# EAGLE design Qwiic_RTC_RV8803 (EAGLE 9.5.2)
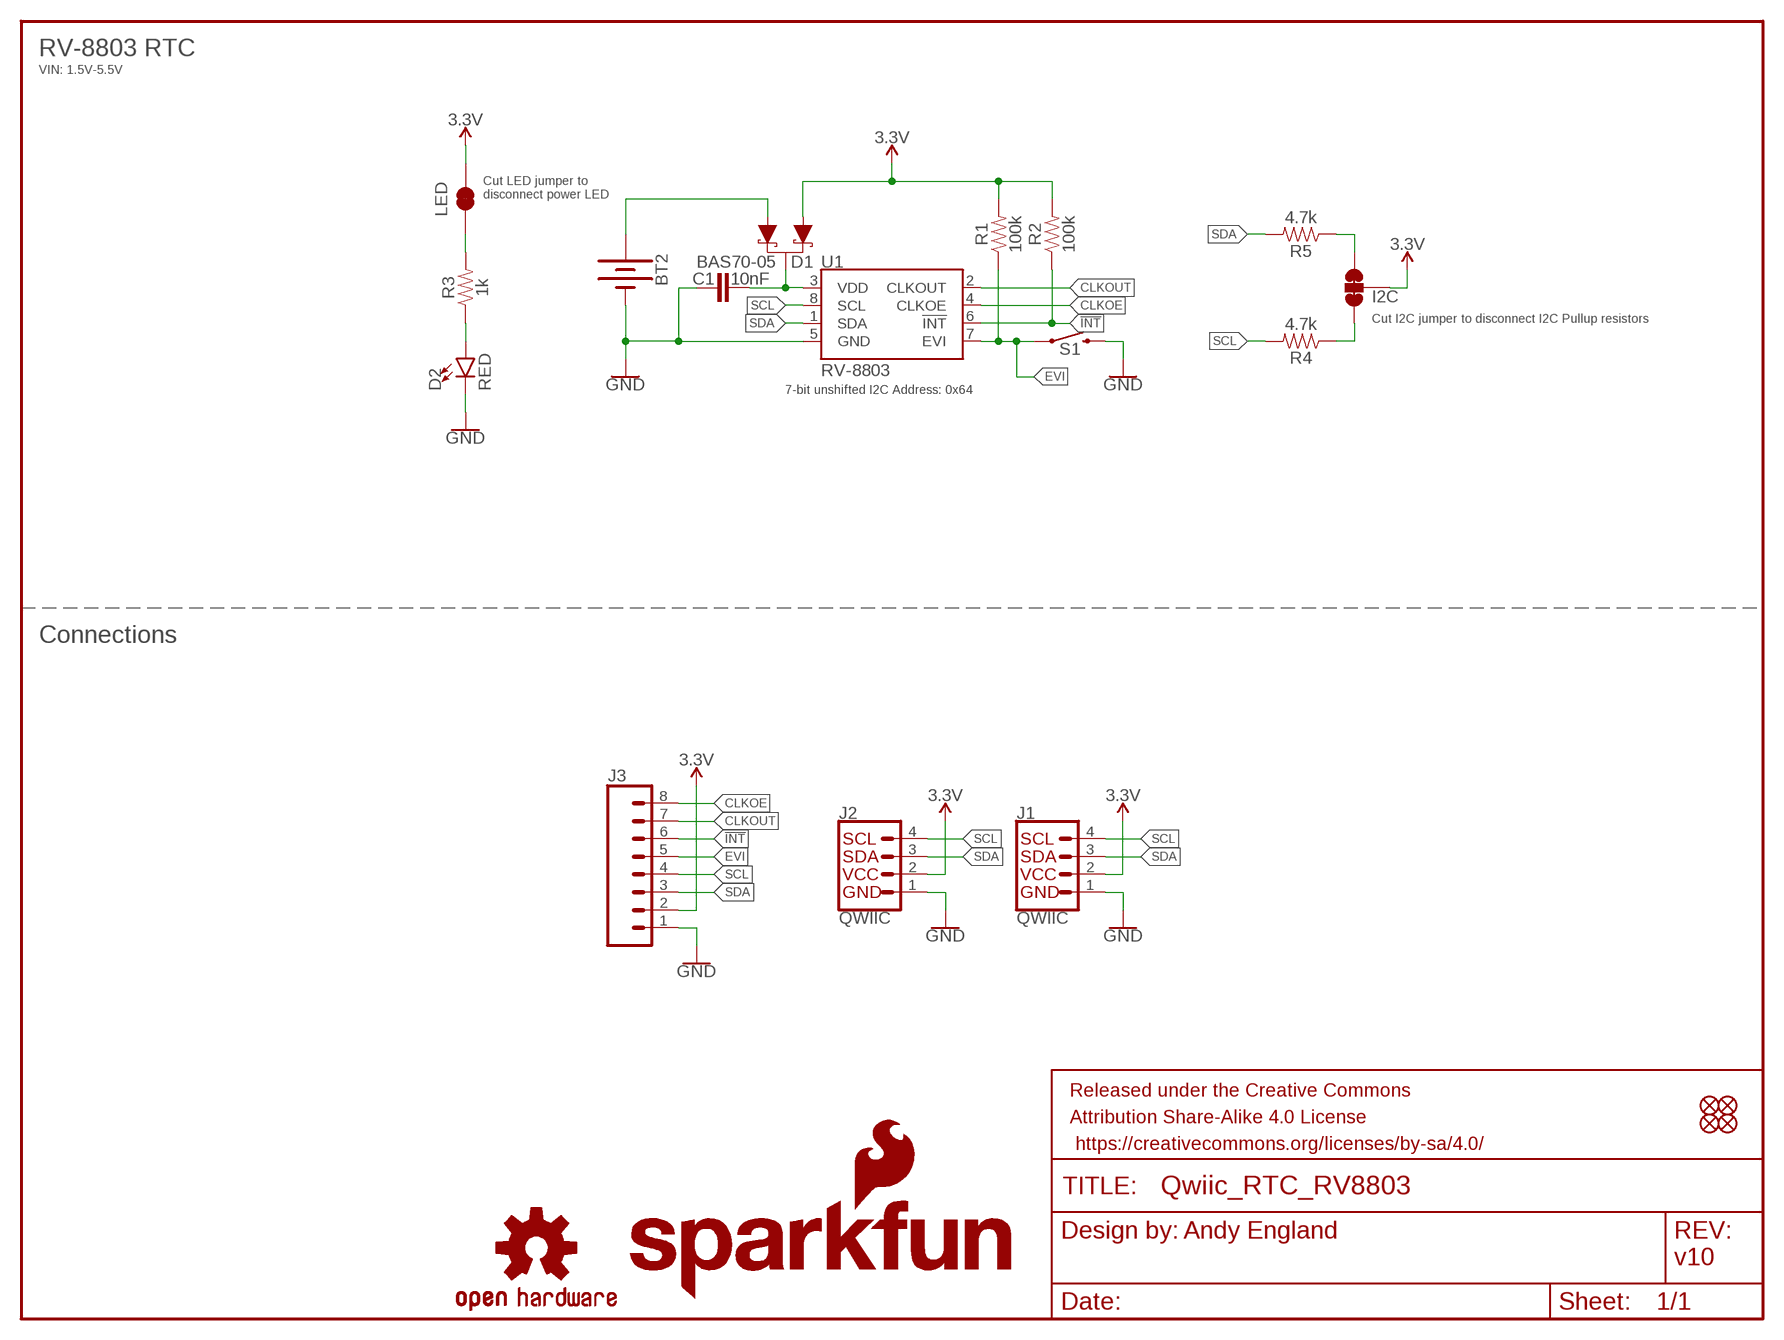
[diagram p0: schematic, sheet 1]

## Parts
BT2  BATTERY-12MM_SMD  [BATTCON_12MM]
C1  10nF  10NF-0603-50V-10%  [0603]
D1  BAS70-05  DIODE-SCHOTTKY-DUAL  [SOT23-3]
D2  RED  LED-RED0603  [LED-0603]
FD1  FIDUCIALUFIDUCIAL  [FIDUCIAL-MICRO]
FD2  FIDUCIALUFIDUCIAL  [FIDUCIAL-MICRO]
FD3  FIDUCIALUFIDUCIAL  [FIDUCIAL-MICRO]
FD4  FIDUCIALUFIDUCIAL  [FIDUCIAL-MICRO]
FRAME1  FRAME-LETTER  [CREATIVE_COMMONS]
I2C  JUMPER-SMT_3_2-NC_TRACE_NO-SILK  [SMT-JUMPER_3_2-NC_TRACE_NO-SILK]
J1  QWIIC  QWIIC_CONNECTORJS-1MM  [JST04_1MM_RA]
J2  QWIIC  QWIIC_CONNECTORJS-1MM  [JST04_1MM_RA]
J3  CONN_08NO_SILK_FEMALE_PTH  [1X08_NO_SILK]
LED  JUMPER-SMT_2_NC_TRACE_NO-SILK  [SMT-JUMPER_2_NC_TRACE_NO-SILK]
LOGO1  SFE_LOGO_NAME_FLAME.1_INCH  [SFE_LOGO_NAME_FLAME_.1]
LOGO2  OSHW-LOGOS  [OSHW-LOGO-S]
LOGO3  SFE_LOGO_FLAME.1_INCH  [SFE_LOGO_FLAME_.1]
R1  100k  100KOHM-0603-1/10W-1%  [0603]
R2  100k  100KOHM-0603-1/10W-1%  [0603]
R3  1k  1KOHM-0603-1/10W-1%  [0603]
R4  4.7k  4.7KOHM-0603-1/10W-1%  [0603]
R5  4.7k  4.7KOHM-0603-1/10W-1%  [0603]
S1  MOMENTARY-SWITCH-SPST-SMD-4.6X2.8MM  [TACTILE_SWITCH_SMD_4.6X2.8MM]
U1  RV-8803  [RV-3028]

## Nets
3.3V: D1.1(A) I2C.2 J1.2 J2.2 J3.2 LED.2 R1.2 R2.2
!INT: J3.6 R2.1 U1.6(!INT)
CLKOE: J3.8 U1.4(CLKOE)
CLKOUT: J3.7 U1.2(CLKOUT)
EVI: J3.5 R1.1 S1.1 S1.2 U1.7(EVI)
GND: BT2.GND(-) C1.1 D2.C J1.1 J2.1 J3.1 S1.3 S1.4 U1.5(GND)
N$1: C1.2 D1.3(C) U1.3(VDD)
N$2: D2.A R3.1
N$3: BT2.PWR@1(+) D1.2(A1)
N$5: LED.1 R3.2
N$6: I2C.3 R5.1
N$7: I2C.1 R4.1
SCL: J1.4 J2.4 J3.4 R4.2 U1.8(SCL)
SDA: J1.3 J2.3 J3.3 R5.2 U1.1(SDA)

## Notes on the sheet
- RV-8803 RTC
- VIN: 1.5V-5.5V
- Cut LED jumper to 
  disconnect power LED
- Cut I2C jumper to disconnect I2C Pullup resistors
- 7-bit unshifted I2C Address: 0x64
- Connections
- Andy England
- v10

## Library data of the parts
BT2 = SparkFun-Batteries:BATTERY: Battery - Single Cell A variety of battery chemistries, sizes, and footprints. Device List: 20MM_PTH - Coin Cell Battery Holder - 20mm (PTH) <https://www.sparkfun.com/products/783> 20MM_PTH_KIT- Coin Cell battery Holder - 20 mm (PTH) <http://www.sparkfun.com/products/783>kit version with special mask 6.8MM_PTH - Coin Cell Battery Holder - 6.8MM(SMD) <https://www.digikey.com/product-detail/en/seiko-instruments/MS621FE-FL11E/728-1057-ND/1889208?WT.srch=1&gclid=CNOQ5a6LzdQCFZS2wAodXCkE0g> 12MM_SMD - Coin Cell Battery Holder - 12mm (SMD) <https://www.sparkfun.com/products/10592> 12MM_PTH - Coin Cell Battery Holder - 12mm (PTH) <https://www.sparkfun.com/products/7948> 20MM_SMD - 20mm Coin Cell Battery Holder (SMD) (2 legs) Used on the Big Time Watch Kit <https://www.sparkfun.com/products/11734> 20MM_SMD_4LEGS - Coin Cell Battery Holder - 20mm (SMD) <https://www.sparkfun.com/products/11892> 20MM_SMD_4LEGS_OVERPASTE - Coin Cell Battery Holder - 20mm (SMD) <https://www.sparkfun.com/products/11892> (Over-paste on the legs) 24.5MM_PTH - Coin Cell Battery Holder - 24.5mm (PTH) <https://www.sparkfun.com/products/8863> 9V - 9V Battery Holder - PC Mount Used on the SparkFun SparkPunk Sound Kit <https://www.sparkfun.com/products/11177> and SparkFun SparkPunk Sequencer Kit <https://www.sparkfun.com/products/12707> 18650 - Battery Holder - 18650 (PTH) <https://www.sparkfun.com/products/13113> AA - Battery Holder - 1xAA (PTH) <https://www.sparkfun.com/products/7949> AAA - Battery Holder - 1xAAA (PTH) <https://www.sparkfun.com/products/12718> AA_KIT - Battery Holder - 1xAA (PTH) <https://www.sparkfun.com/products/7949> Special kit package - pads only have exposed copper on one side of the board. AAA_KIT - Battery Holder - 1xAAA (PTH) <https://www.sparkfun.com/products/12718> Special kit package - pads only have exposed copper on one side of the board.; PROD_ID: BATT-08044; SF_SKU: PRT-10592
C1 = SparkFun-Capacitors:10NF: 0.01uF/10nF/10,000pF ceramic capacitors A capacitor is a passive two-terminal electrical component used to store electrical energy temporarily in an electric field. CAP-09321; PROD_ID: CAP-00867
D1 = SparkFun-DiscreteSemi:DIODE-SCHOTTKY-DUAL: Diodes Incorporated - BAS70-05 Dual Schottky Diode Two Schottky Diodes in a single SOT-23 package. Low reverse current (100 nA) Vf: Datasheet referenced for footprint <https://www.diodes.com/assets/Datasheets/ds11007.pdf>; PROD_ID: DIO-14829
D2 = SparkFun-LED:LED-RED: Red SMD LED Used in manufacturing of most products at SparkFun Packages: 0603 - SMD 0603 package [Product Link] <http://docs.avagotech.com/docs/AV02-0551EN> 0603 SMART - SMD 0603 SMART package ( more efficient and expensive)[Product Link] <http://www.osram-os.com/Graphics/XPic2/00077099_0.pdf> 1206 - SMD1206 package [Product Link] <https://www.sparkfun.com/datasheets/DevTools/LilyPad/Q150OVS4.pdff> SparkFun Products: Pro Mini 328 -5V <https://www.sparkfun.com/products/821> RedBoard <https://www.sparkfun.com/products/12757> IOIO-OTG <https://www.sparkfun.com/products/13613>; PROD_ID: DIO-00819
FD1-FD4 = SparkFun-Aesthetics:FIDUCIAL: Fiducial Alignment Points Point-of-reference for pick-and-place machines and other optical instruments.
FRAME1 = SparkFun-Aesthetics:FRAME-LETTER: Schematic Frame - Letter Standard 8.5x11 US Letter frame
I2C = SparkFun-Jumpers:JUMPER-SMT_3_2-NC_TRACE: Normally closed trace jumper (2 of 2 connections) This jumper has a trace between all three pads so they are normally closed (NC). Use a razor knife to open the connection(s). For best results follow the IPC guidelines for cutting traces: Cutout at least 0.063 mm (0.005 in). Remove all loose material to clean up the cut area. Seal the cut with an approved epoxy. Reapply solder to reclose the connection(s).
J1 J2 = SparkFun-Connectors:QWIIC_CONNECTOR: SparkFun I2C Standard Qwiic Connector An SMD 1mm pitch JST connector makes it easy and quick (get it? Qwiic?) to connect I2C devices to each other. The Qwiic system <http://www.sparkfun.com/qwiic> enables fast and solderless connection between popular platforms and various sensors and actuators. We carry 200mm <https://www.sparkfun.com/products/14204>, 100mm <https://www.sparkfun.com/products/14205>, 50mm <https://www.sparkfun.com/products/14206>, and breadboard friendly <https://www.sparkfun.com/products/14207> Qwiic cables. We also offer 10 pcs strips <https://www.sparkfun.com/products/14323> the SMD connectors.; PROD_ID: CONN-13694; VALUE: QWIIC_RIGHT_ANGLE
J3 = SparkFun-Connectors:CONN_08: Multi connection point. Often used as Generic Header-pin footprint for 0.1 inch spaced/style header connections On any of the 0.1 inch spaced packages, you can populate with these: Break Away Headers - Straight <https://www.sparkfun.com/products/116> (PRT-00116) Break Away Male Headers - Right Angle <https://www.sparkfun.com/products/553> (PRT-00553) Female Headers <https://www.sparkfun.com/products/115> (PRT-00115) Break Away Headers - Machine Pin <https://www.sparkfun.com/products/117> (PRT-00117) Break Away Female Headers - Swiss Machine Pin <https://www.sparkfun.com/products/743> (PRT-00743) Arduino Stackable Header - 8 Pin <https://www.sparkfun.com/products/9279> (PRT-09279) For SCREWTERMINALS and SPRING TERMINALS visit here: Screw Terimnals on SparkFun.com <https://www.sparkfun.com/search/results?term=Screw+Terminals> (5mm/3.5mm/2.54mm spacing) This device is also useful as a general connection point to wire up your design to another part of your project. Our various solder wires solder well into these plated through hole pads. Hook-Up Wire - Assortment (Stranded, 22 AWG) <https://www.sparkfun.com/products/11375> (PRT-11375) Hook-Up Wire - Assortment (Solid Core, 22 AWG) <https://www.sparkfun.com/products/11367> (PRT-11367) View the entire wire category on our website here <https://www.sparkfun.com/categories/141> Special notes: Molex polarized connector foot print use with SKU : PRT-08231 with associated crimp pins and housings. 1MM SMD Version SKU: PRT-10208 NOTES ON THE VARIANTS LOCK and LOCK_LONGPADS... This footprint was designed to help hold the alignment of a through-hole component (i.e. 6-pin header) while soldering it into place. You may notice that each hole has been shifted either up or down by 0.005 of an inch from it's more standard position (which is a perfectly straight line). This slight alteration caused the pins (the squares in the middle) to touch the edges of the holes. Because they are alternating, it causes a "brace" to hold the component in place. 0.005 has proven to be the perfect amount of "off-center" position when using our standard breakaway headers. Although looks a little odd when you look at the bare footprint, once you have a header in there, the alteration is very hard to notice. Also,if you push a header all the way into place, it is covered up entirely on the bottom side.; PROD_ID: CONN-08438
LED = SparkFun-Jumpers:JUMPER-SMT_2_NC_TRACE: Normally closed trace jumper This jumper has a trace between two pads so it's normally closed (NC). Use a razor knife to open the connection. For best results follow the IPC guidelines for cutting traces: Cutout at least 0.063 mm (0.005 in). Remove all loose material to clean up the cut area. Seal the cut with an approved epoxy. Reapply solder to reclose the connection.
LOGO1 = SparkFun-Aesthetics:SFE_LOGO_NAME_FLAME: SparkFun Font Logo w/ Flame This is the SparkFun full logo. The logo on the schematic will always be the same size; the package variant is the height of the flame part of the logo. Default layer for the logo on the board is tSilk.
LOGO2 = SparkFun-Aesthetics:OSHW-LOGO: Open-Source Hardware (OSHW) Logo This logo indicates the piece of hardware it is found on incorporates a OSHW license and/or adheres to the definition of open source hardware found here: http://freedomdefined.org/OSHW
LOGO3 = SparkFun-Aesthetics:SFE_LOGO_FLAME: SparkFun Flame Logo This is the SparkFun flame logo. The logo on the schematic will always be the same size; the package variant is the height of the flame. Default layer for the logo on the board is tSilk.
R1 R2 = SparkFun-Resistors:100KOHM: 100kΩ resistor A resistor is a passive two-terminal electrical component that implements electrical resistance as a circuit element. Resistors act to reduce current flow, and, at the same time, act to lower voltage levels within circuits. - Wikipedia; PROD_ID: RES-07828
R3 = SparkFun-Resistors:1KOHM: 1kΩ resistor A resistor is a passive two-terminal electrical component that implements electrical resistance as a circuit element. Resistors act to reduce current flow, and, at the same time, act to lower voltage levels within circuits. - Wikipedia; PROD_ID: RES-07856
R4 R5 = SparkFun-Resistors:4.7KOHM: 4.7kΩ resistor A resistor is a passive two-terminal electrical component that implements electrical resistance as a circuit element. Resistors act to reduce current flow, and, at the same time, act to lower voltage levels within circuits. - Wikipedia; PROD_ID: RES-07857
S1 = SparkFun-Switches:MOMENTARY-SWITCH-SPST: Momentary Switch (Pushbutton) - SPST Normally-open (NO) SPST momentary switches (buttons, pushbuttons). Variants PTH-12MM - 12mm square, through-hole Momentary Pushbutton Switch - 12mm Square <https://www.sparkfun.com/products/9190> (COM-09190) PTH-6.0MM, PTH-6.0MM-KIT - 6.0mm square, through-hole Mini Pushbutton Switch <https://www.sparkfun.com/products/97> (COM-00097) KIT package intended for soldering kit's - only one side of pads' copper is exposed. PTH-RIGHT-ANGLE-KIT - Right-angle, through-hole Right Angle Tactile Button <https://www.sparkfun.com/products/10791> - Used on SparkFun BigTime Watch Kit <https://www.sparkfun.com/products/11734> SMD-12MM - 12mm square, surface-mount Tactile Button - SMD (12mm) <https://www.sparkfun.com/products/12993> (COM-12993) Used on SparkFun PicoBoard <https://www.sparkfun.com/products/11888> SMD-4.5MM - 4.5mm Square Trackball Switch Used on SparkFun Blackberry Trackballer Breakout <https://www.sparkfun.com/products/13169> SMD-4.6MMX2.8MM - 4.60mm x 2.80mm, surface mount Used on SparkFun SAMD21 Mini Breakout <https://www.sparkfun.com/products/13664> SMD-5.2MM, SMD-5.2-REDUNDANT - 5.2mm square, surface-mount Mini Pushbutton Switch - SMD <https://www.sparkfun.com/products/8720> (COM-08720) Used on Arduino Pro Mini <https://www.sparkfun.com/products/11114> REDUNDANT package connects both switch circuits together SMD-6.0X3.5MM - 6.0 x 3.5mm, surface mount Momentary Reset Switch SMD <https://www.sparkfun.com/products/8229> (COM-08229) SMD-6.2MM-TALL - 6.2mm square, surface mount Tactile Button - SMD (6mm) <https://www.sparkfun.com/products/12992> Used on SparkFun Digital Sandbox <https://www.sparkfun.com/products/12651> SMD-RIGHT-ANGLE - Right-angle, surface mount Used on SparkFun Block for Intel® Edison - Arduino <https://www.sparkfun.com/products/13036>; PROD_ID: SWCH-13065
U1 = SparkFun-Clocks:RV-8803: Micro Crystal RV-8803 - Temperature compensated RTC Ultra accurate plus/minus 3PPM I2C RTC. Temperature compensated crystal for low drift; PROD_ID: IC-14828

## Board
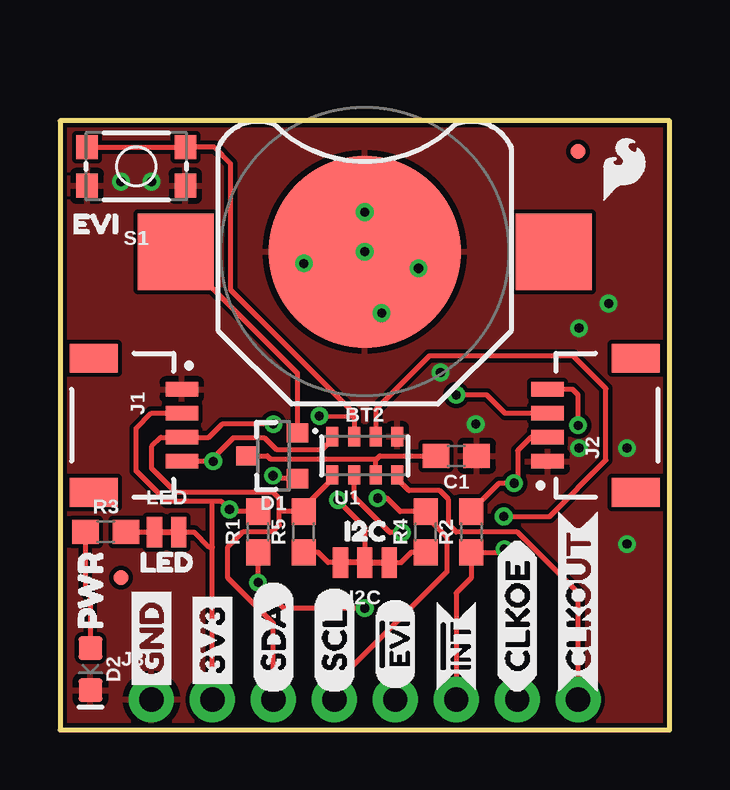
[diagram p1: board, top side]
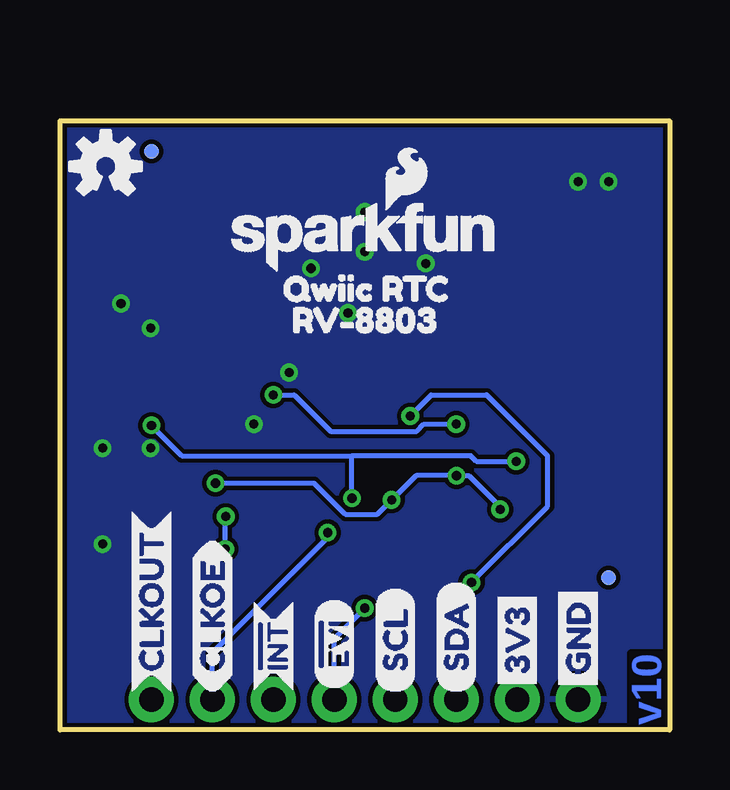
[diagram p2: board, bottom side, seen from below]

Size 25.4 x 25.4 mm. Coordinates in mm from the lower left corner, seen from the top.
Outline: 0,0 25.4,0 25.4,25.4 0,25.4 0,0
Copper layers (1*16): Top 0.035mm / dielectric 1.5mm / Bottom 0.035mm
Design rules "SparkFun-2-layer-TIGHT": minimum track width 7mil, minimum drill 15mil, track to track 7mil, track to pad 7mil, pad to pad 7mil, via to via 7mil, smd to smd 7mil, copper to edge 7mil, drill to drill 7mil, minimum pad ring 7mil, minimum via ring 7mil, stop-mask expansion 4mil, vias tented up to drill 25mil, thermal gap 10mil

### Footprints (pad centres in the part's own frame; a part is rotated, then mirrored left to right if it is on the bottom)
BATTCON_12MM = smd 8 x 8: GND 0,0 | smd 3.175 x 3.175: PWR@1 -7.874,0; PWR@2 7.874,0
0603 = smd 1.1 x 1: 1 -0.85,0; 2 0.85,0
SOT23-3 = smd 0.8 x 0.9: 1 -0.95,-1; 2 0.95,-1; 3 0,1.1
LED-0603 = smd 1 x 1: A -0.877,0; C 0.877,0
FIDUCIAL-MICRO = smd 0.635 x 0.635: 1 0,0
SMT-JUMPER_3_2-NC_TRACE_NO-SILK = smd 0.635 x 1.27: 1 -1.016,0; 2 0,0; 3 1.016,0
JST04_1MM_RA = smd 0.6 x 1.35: 1 -1.5,0; 2 -0.5,0; 3 0.5,0; 4 1.5,0 | smd 1.2 x 2: NC1 2.8,-3.675; NC2 -2.8,-3.675
1X08_NO_SILK = drill 1.016 pad 1.88: 1 0,0; 2 2.54,0; 3 5.08,0; 4 7.62,0; 5 10.16,0; 6 12.7,0; 7 15.24,0; 8 17.78,0
SMT-JUMPER_2_NC_TRACE_NO-SILK = smd 0.635 x 1.27: 1 -0.508,0; 2 0.508,0
TACTILE_SWITCH_SMD_4.6X2.8MM = smd 0.9 x 1: 1 -2.05,-0.8; 2 2.05,-0.8; 3 2.05,0.8; 4 -2.05,0.8
RV-3028 = smd 0.5 x 0.8: 1 -1.35,-0.8; 2 -0.45,-0.8; 3 0.45,-0.8; 4 1.35,-0.8; 5 1.35,0.8; 6 0.45,0.8; 7 -0.45,0.8; 8 -1.35,0.8

### Placement (x,y rotation side)
BT2  12.7,19.94 0 top
C1  16.51,11.43 180 top
D1  8.89,11.43 90 top
D2  1.27,2.54 270 top
FD1  2.54,6.35 0 top
FD2  2.54,6.35 0 bottom
FD3  21.59,24.13 0 top
FD4  21.59,24.13 0 bottom
FRAME1  -11.43,-8.89 0 top  (outside the outline)
I2C  12.7,6.99 180 top
J1  5.08,12.7 270 top
J2  20.32,12.7 90 top
J3  3.81,1.27 0 top
LED  4.45,8.26 0 top
LOGO1  12.7,20.57 0 bottom
LOGO2  23.5,23.5 0 bottom
LOGO3  23.5,23.4 0 top
R1  8.26,8.26 90 top
R2  17.14,8.26 90 top
R3  1.91,8.26 0 top
R4  15.24,8.26 90 top
R5  10.16,8.26 90 top
S1  3.17,23.5 180 top
U1  12.7,11.43 0 top
U$1  [3V31]  6.35,1.4 90 top
U$2  [3V31]  6.35,1.4 90 bottom
U$3  [GND0]  3.81,1.4 90 top
U$4  [GND0]  3.81,1.4 90 bottom
U$5  [SDA2]  8.89,1.52 90 top
U$6  [SDA2]  8.89,1.52 90 bottom
U$7  [SCL3]  11.43,1.52 90 top
U$8  [SCL3]  11.43,1.52 90 bottom
U$9  [#EVI2]  13.97,1.52 90 top
U$10  [#EVI2]  13.97,1.52 90 bottom
U$11  [CLKOUT6]  21.59,1.52 90 top
U$12  [CLKOUT6]  21.59,1.52 90 bottom
U$13  [CLKOE7]  19.05,1.52 90 top
U$14  [CLKOE7]  19.05,1.52 90 bottom
U$15  [#INT5]  16.51,1.4 90 top
U$16  [#INT5]  16.51,1.4 90 bottom
U$17  [PWR7]  1.27,3.3 90 top
U$18  [EVI1]  -0.2,21.1 0 top
U$19  [I2C0]  11.1,8.3 0 top
U$20  [LED2]  2.6,7 0 top
U$21  [QWIIC_RTC0]  17,18.4 0 bottom
U$22  [_RV#88031]  17,17.1 0 bottom

### Tracks (layer width: path | path; a pad name or v marks a point on that pad's centre or on a via)
3.3V  (via drill 0.38)
  Top 0.203: J1.2 3.81,13.21 3.17,12.57 3.17,10.79 4.45,9.53 6.35,9.53 | R1.2 7.15,9.11 v7.06,9.2 6.73,9.53 6.35,9.53 | J3.2 6.35,7.62 | 6.35,7.62 6.35,9.53 | LED.2 5.59,8.26 6.22,7.62 6.35,7.62 | J2.2 19.62,12.2 19.07,11.65 19.07,10.43 v18.92,10.29 18.29,10.29 17.11,9.11 R2.2 | D1.1 9,10.48 v8.88,10.6 | v11.58,9.59 11.58,9.56 12.7,8.45 I2C.2
  Bottom 0.203: v7.06,9.2 7.06,9.3 8.37,10.6 v8.88,10.6 10.57,10.6 v11.58,9.59 12.18,8.99 13.51,8.99 14.81,10.29 v18.92,10.29
!INT  (via drill 0.38)
  Top 0.203: J3.6 16.51,5.71 17.14,6.35 R2.1 18.38,7.41 v18.52,7.54 | v18.49,8.9 20.4,8.9 22.75,11.25 22.75,14.23 21.38,15.6 15.39,15.6 13.15,13.35 U1.6
  Bottom 0.203: v18.52,7.54 18.52,8.88 v18.49,8.9
CLKOE
  Top 0.203: J3.8 21.59,5.71 19.05,8.26 16.51,8.26 16.19,8.57 16.19,9 16.19,9.39 16.19,9.61 15.82,9.98 14.54,9.98 14.05,10.47 U1.4
CLKOUT  (via drill 0.38)
  Top 0.203: U1.2 12.25,9.72 13.74,8.23 v14.25,8.23
  Bottom 0.203: J3.7 19.05,3.23 14.25,8.03 | v14.25,8.23 14.25,8.03 | 14.25,8.03
EVI  (via drill 0.38)
  Top 0.178: 12.25,13.06 10.84,13.06 v10.81,13.09
  Top 0.203: U1.7 12.25,13.06 12.25,13.2 7.11,18.34 7.11,23.62 6.44,24.3 S1.1 S1.2 | R1.1 v8.26,6.15 9.32,5.08 v12.7,5.08
  Bottom 0.203: v12.7,5.08 13.97,3.81 J3.5 | v10.81,13.09 9.93,13.97 7.62,13.97 5.08,11.43 5.08,9.32 v8.26,6.15
GND  (via drill 0.38)
  other vias: 22.86,17.78 12.7,19.94 10.16,19.45 13.4,17.38 14.94,19.25 12.7,21.59 17.32,12.75 15.85,14.9 2.54,22.86 3.81,22.86 21.62,11.75 23.62,11.75 23.62,7.75 21.62,16.75
  pour Top: 0,0 25.4,0 25.4,25.4 0,25.4
  pour Bottom: 25.4,0 0,0 0,25.4 25.4,25.4
N$1
  Top 0.203: D1.3 8.64,11.43 8.76,11.31 13.21,11.31 | U1.3 13.15,11.25 13.21,11.31 | C1.2 13.33,11.43 13.21,11.31
N$2
  Top 0.203: R3.1 1.05,5.82 1.27,5.6 D2.A
N$3
  Top 0.203: BT2.PWR@1 9.89,14.88 D1.2
N$5
  Top 0.203: R3.2 LED.1
N$6
  Top 0.203: I2C.3 11.18,6.99 10.76,7.41 R5.1
N$7
  Top 0.203: R4.1 14.64,7.41 14.22,6.99 I2C.1
SCL  (via drill 0.38)
  Top 0.203: J3.4 11.43,1.91 16.13,6.6 16.13,8.04 15.24,8.93 R4.2 14.17,9.11 13.61,9.66 v13.23,9.66 | J1.4 v6.39,11.2 6.39,11.34 7.24,12.19 8.51,12.19 9,11.7 10.93,11.7 11.35,12.12 U1.8 | v21.59,12.7 21.59,13.97 21.36,14.2 J2.4
  Bottom 0.203: 13.23,11.43 8.28,11.43 8.05,11.2 v6.39,11.2 | 13.23,11.43 20.32,11.43 v21.59,12.7 | v13.23,9.66 13.23,11.43
SDA  (via drill 0.38)
  Top 0.203: J3.3 8.89,4.45 7,6.34 7,7.63 7.64,8.28 8.87,8.28 9.14,8.55 9.14,9.14 | J2.3 18.55,13.2 17.78,13.97 v16.51,13.97 | v8.89,12.75 6.75,12.75 6.2,12.2 J1.3 4.2,12.2 3.81,11.81 3.81,10.92 4.8,9.93 8.87,9.93 9.14,9.66 9.14,9.14 | U1.1 11.35,10.46 10.16,9.27 R5.2 9.18,9.11 9.14,9.14
  Bottom 0.203: v16.51,13.97 15.65,13.97 14.12,12.45 10.54,12.45 10.23,12.75 v8.89,12.75

### Text on the board
Bottom: v10
Measures: Units in Inches
tDocu: Andy England